# EAGLE design Motor Shield (EAGLE 9.6.2)
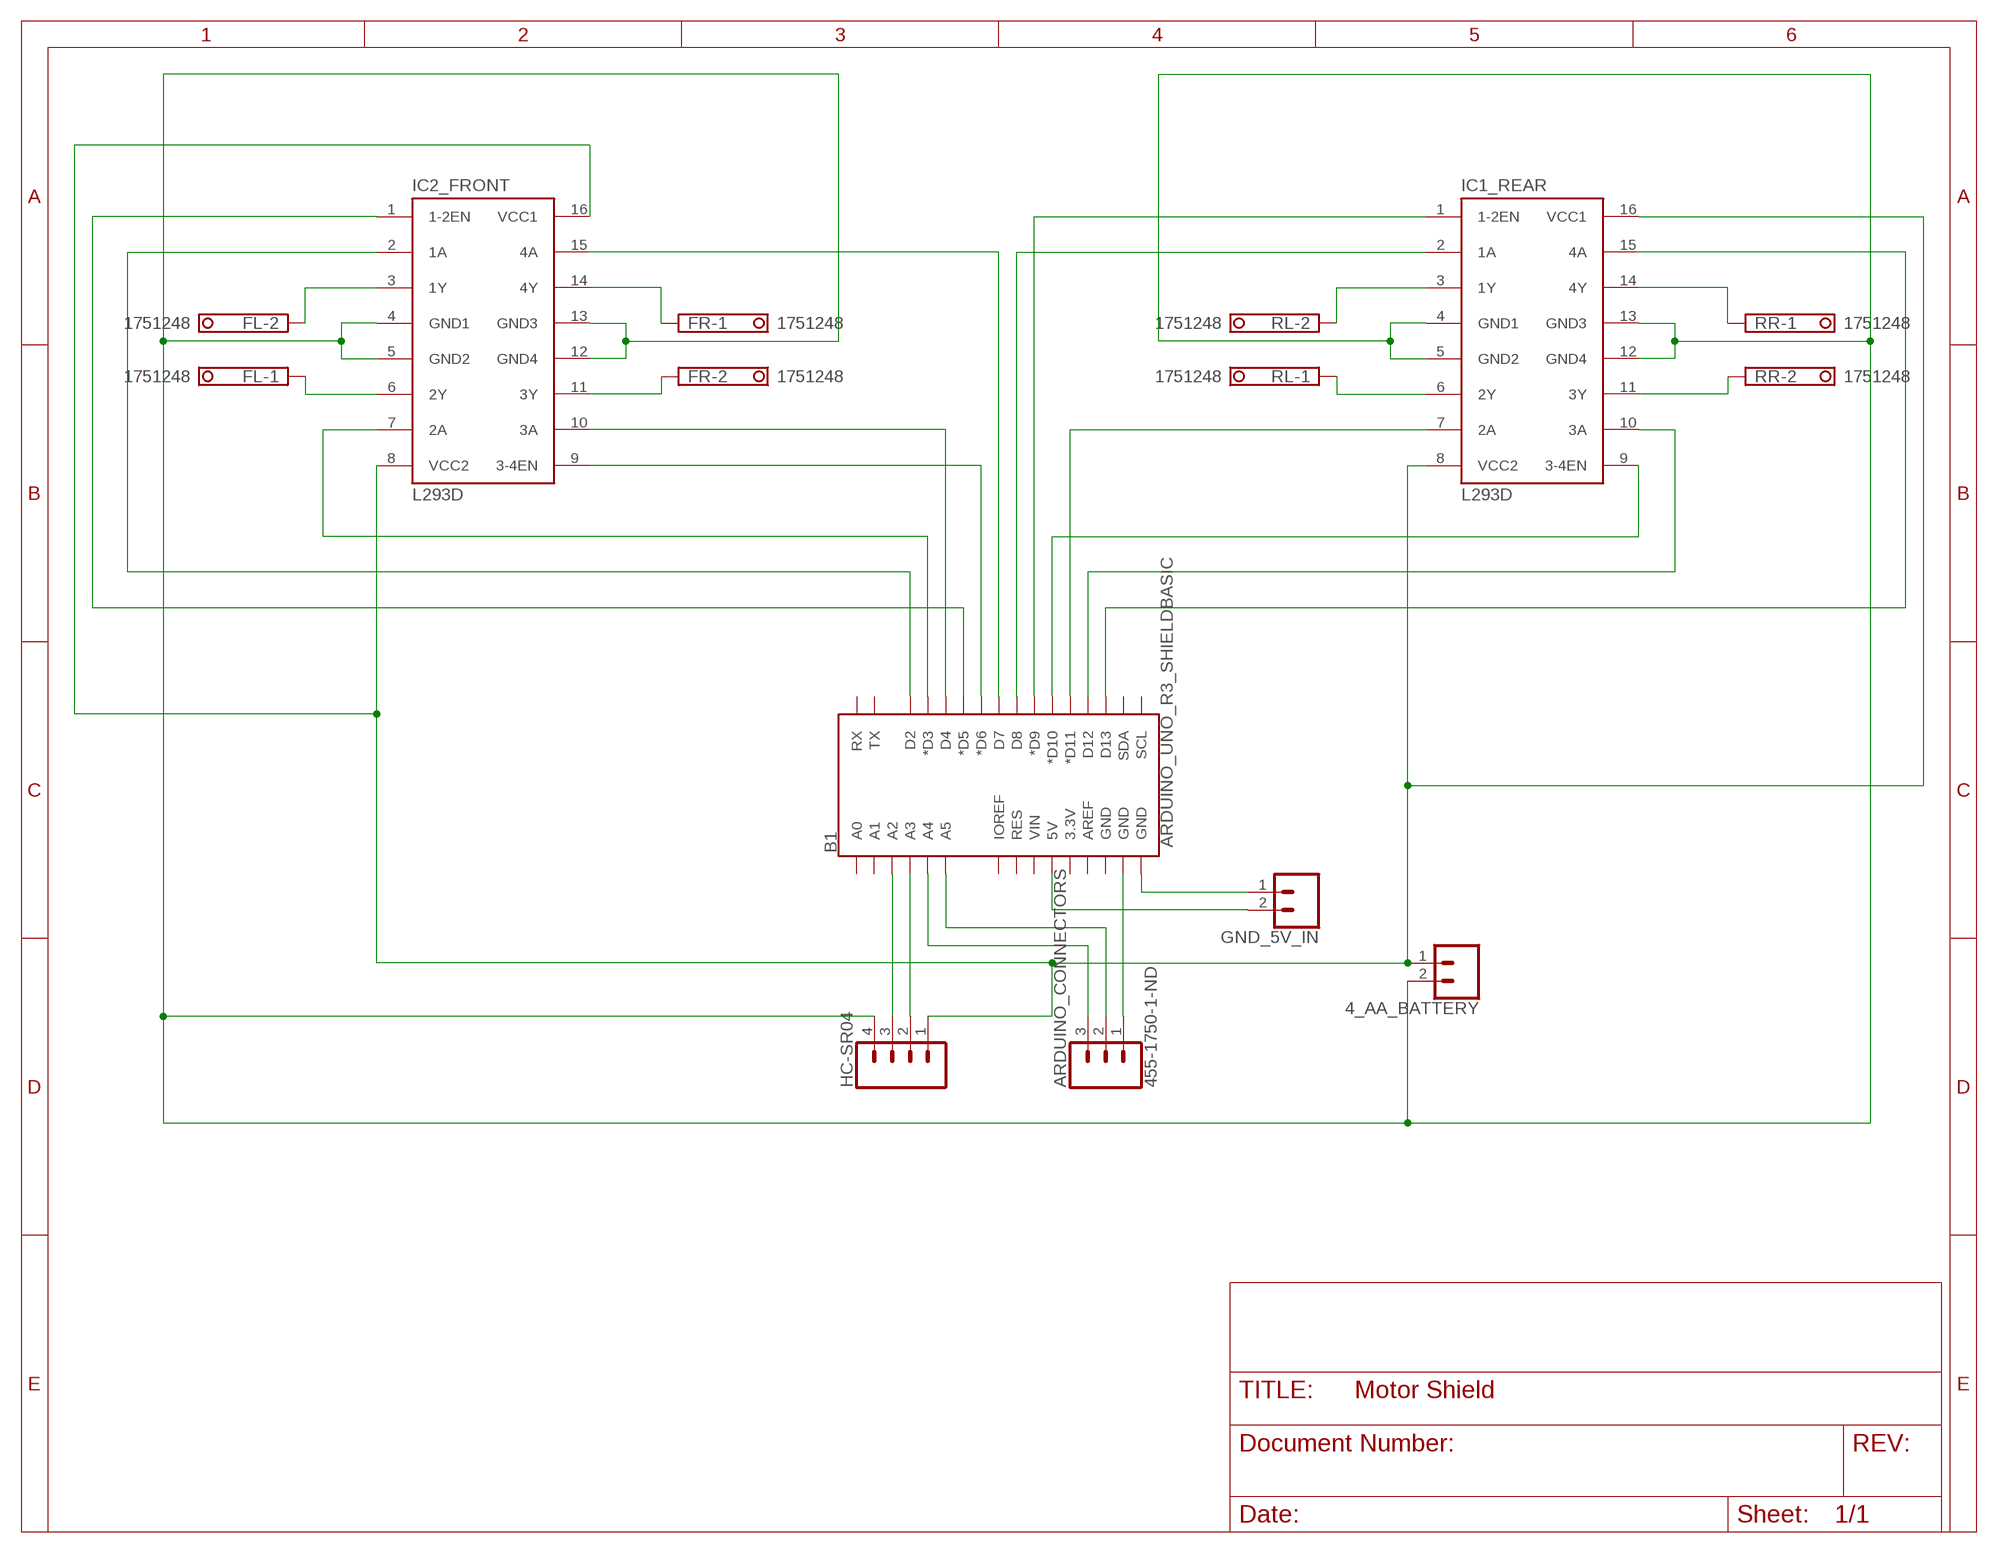
[diagram p0: schematic, sheet 1]

## Parts
4_AA_BATTERY  CONN_02  [1X02]
ARDUINO_CONNECTORS  455-1750-1-ND  CONN_03  [1X03]
B1  ARDUINO_UNO_R3_SHIELDBASIC  [UNO_R3_SHIELD]
FL  1751248  [1751248]
FR  1751248  [1751248]
GND_5V_IN  CONN_02  [1X02]
HC-SR04  CONN_04PTH  [1X04]
IC1_REAR  L293D  [DIL16]
IC2_FRONT  L293D  [DIL16]
RL  1751248  [1751248]
RR  1751248  [1751248]

## Nets
D2: B1.D2 IC2_FRONT.2(1A)
D3: B1.D3(*D3) IC2_FRONT.7(2A)
D5: B1.D5(*D5) IC2_FRONT.1(1-2EN)
GND: 4_AA_BATTERY.2 HC-SR04.4 IC1_REAR.4(GND1) IC1_REAR.5(GND2) IC1_REAR.12(GND4) IC1_REAR.13(GND3) IC2_FRONT.4(GND1) IC2_FRONT.5(GND2) IC2_FRONT.12(GND4) IC2_FRONT.13(GND3)
N$1: FL.2 IC2_FRONT.3(1Y)
N$2: FL.1 IC2_FRONT.6(2Y)
N$3: FR.1 IC2_FRONT.14(4Y)
N$4: FR.2 IC2_FRONT.11(3Y)
N$5: IC1_REAR.3(1Y) RL.2
N$6: IC1_REAR.14(4Y) RR.1
N$7: IC1_REAR.6(2Y) RL.1
N$8: IC1_REAR.11(3Y) RR.2
N$9: B1.GND@0(GND) GND_5V_IN.1
N$10: B1.D10(*D10) IC1_REAR.9(3-4EN)
N$11: B1.5V GND_5V_IN.2
N$12: B1.A2 HC-SR04.3
N$13: B1.A3 HC-SR04.2
N$14: B1.D11(*D11) IC1_REAR.7(2A)
N$15: ARDUINO_CONNECTORS.3 B1.A4
N$16: B1.D9(*D9) IC1_REAR.1(1-2EN)
N$17: B1.D12 IC1_REAR.10(3A)
N$18: B1.D13 IC1_REAR.15(4A)
N$19: B1.D8 IC1_REAR.2(1A)
N$20: B1.D7 IC2_FRONT.15(4A)
N$21: B1.D6(*D6) IC2_FRONT.9(3-4EN)
N$22: ARDUINO_CONNECTORS.2 B1.A5
N$23: B1.D4 IC2_FRONT.10(3A)
N$24: ARDUINO_CONNECTORS.1 B1.GND@1(GND)
VCC: 4_AA_BATTERY.1 HC-SR04.1 IC1_REAR.8(VCC2) IC1_REAR.16(VCC1) IC2_FRONT.8(VCC2) IC2_FRONT.16(VCC1)
Unconnected: B1.3.3V B1.A0 B1.A1 B1.AREF B1.GND@2(GND) B1.IOREF B1.RES B1.RX B1.SCL B1.SDA B1.TX B1.VIN

## Library data of the parts
4_AA_BATTERY GND_5V_IN = SparkFun-Connectors:CONN_02: Multi connection point. Often used as Generic Header-pin footprint for 0.1 inch spaced/style header connections On any of the 0.1 inch spaced packages, you can populate with these: Break Away Headers - Straight <https://www.sparkfun.com/products/116> (PRT-00116) Break Away Male Headers - Right Angle <https://www.sparkfun.com/products/553> (PRT-00553) Female Headers <https://www.sparkfun.com/products/115> (PRT-00115) Break Away Headers - Machine Pin <https://www.sparkfun.com/products/117> (PRT-00117) Break Away Female Headers - Swiss Machine Pin <https://www.sparkfun.com/products/743> (PRT-00743) For SCREWTERMINALS and SPRING TERMINALS visit here: Screw Terimnals on SparkFun.com <https://www.sparkfun.com/search/results?term=Screw+Terminals> (5mm/3.5mm/2.54mm spacing) This device is also useful as a general connection point to wire up your design to another part of your project. Our various solder wires solder well into these plated through hole pads. Hook-Up Wire - Assortment (Stranded, 22 AWG) <https://www.sparkfun.com/products/11375> (PRT-11375) Hook-Up Wire - Assortment (Solid Core, 22 AWG) <https://www.sparkfun.com/products/11367> (PRT-11367) View the entire wire category on our website here <https://www.sparkfun.com/categories/141> Special notes: Molex polarized connector foot print use with: PRT-08233 with associated crimp pins and housings. 2.54_SCREWTERM for use with PRT-10571. 3.5mm Screw Terminal footprints for PRT-08084 5mm Screw Terminal footprints for use with PRT-08432
ARDUINO_CONNECTORS = SparkFun-Connectors:CONN_03: Multi connection point. Often used as Generic Header-pin footprint for 0.1 inch spaced/style header connections On any of the 0.1 inch spaced packages, you can populate with these: Break Away Headers - Straight <https://www.sparkfun.com/products/116> (PRT-00116) Break Away Male Headers - Right Angle <https://www.sparkfun.com/products/553> (PRT-00553) Female Headers <https://www.sparkfun.com/products/115> (PRT-00115) Break Away Headers - Machine Pin <https://www.sparkfun.com/products/117> (PRT-00117) Break Away Female Headers - Swiss Machine Pin <https://www.sparkfun.com/products/743> (PRT-00743) Stackable Header - 3 Pin (Female, 0.1") <https://www.sparkfun.com/products/13875> (PRT-13875) For SCREWTERMINALS and SPRING TERMINALS visit here: Screw Terimnals on SparkFun.com <https://www.sparkfun.com/search/results?term=Screw+Terminals> (5mm/3.5mm/2.54mm spacing) This device is also useful as a general connection point to wire up your design to another part of your project. Our various solder wires solder well into these plated through hole pads. Hook-Up Wire - Assortment (Stranded, 22 AWG) <https://www.sparkfun.com/products/11375> (PRT-11375) Hook-Up Wire - Assortment (Solid Core, 22 AWG) <https://www.sparkfun.com/products/11367> (PRT-11367) View the entire wire category on our website here <https://www.sparkfun.com/categories/141> Special notes: Molex polarized connector foot print use with SKU : PRT-08232 with associated crimp pins and housings.; PROD_ID: XXX-00000
B1 = SparkFun-Boards:ARDUINO_UNO_R3_SHIELD: Arduino R3 Shield Footprint Shield form compatible with the Arduino Uno R3. SparkFun Products: MG2639 Cellular Shield <https://www.sparkfun.com/products/13120> MIDI Shield <https://www.sparkfun.com/products/12898> R3 Stackable Headers Kit <https://www.sparkfun.com/products/11417>
FL FR RL RR = con-phoenix-350:1751248: MKDS 1/ 2-3,5 Printklemme Nennstrom: 10 A Bemessungsspannung: 160 V Raster: 3,5 mm Polzahl: 2 Montageart: Löten Anschlussart: Schraubanschluss Anschlussrichtung vom Leiter zur Platine: 0° Source: http://eshop.phoenixcontact.com .. 1751248.pdf; OC_FARNELL: unknown; OC_NEWARK: unknown
HC-SR04 = SparkFun-Connectors:CONN_04: Multi connection point. Often used as Generic Header-pin footprint for 0.1 inch spaced/style header connections On any of the 0.1 inch spaced packages, you can populate with these: Break Away Headers - Straight <https://www.sparkfun.com/products/116> (PRT-00116) Break Away Male Headers - Right Angle <https://www.sparkfun.com/products/553> (PRT-00553) Female Headers <https://www.sparkfun.com/products/115> (PRT-00115) Break Away Headers - Machine Pin <https://www.sparkfun.com/products/117> (PRT-00117) Break Away Female Headers - Swiss Machine Pin <https://www.sparkfun.com/products/743> (PRT-00743) For SCREWTERMINALS and SPRING TERMINALS visit here: Screw Terimnals on SparkFun.com <https://www.sparkfun.com/search/results?term=Screw+Terminals> (5mm/3.5mm/2.54mm spacing) This device is also useful as a general connection point to wire up your design to another part of your project. Our various solder wires solder well into these plated through hole pads. Hook-Up Wire - Assortment (Stranded, 22 AWG) <https://www.sparkfun.com/products/11375> (PRT-11375) Hook-Up Wire - Assortment (Solid Core, 22 AWG) <https://www.sparkfun.com/products/11367> (PRT-11367) View the entire wire category on our website here <https://www.sparkfun.com/categories/141> Special notes: Molex polarized connector foot print use with SKU : PRT-08231 with associated crimp pins and housings. 1MM SMD Version SKU: PRT-10208; PROD_ID: CONN-09696
IC1_REAR IC2_FRONT = st-microelectronics:L293D: PUSH-PULL 4 CHANNEL DRIVER; MPN: L293D; OC_FARNELL: 9589619; OC_NEWARK: 56P8249

## Net classes
0 default: width 1.016 mm, drill 1.016 mm, clearance 0.508 mm

## Board
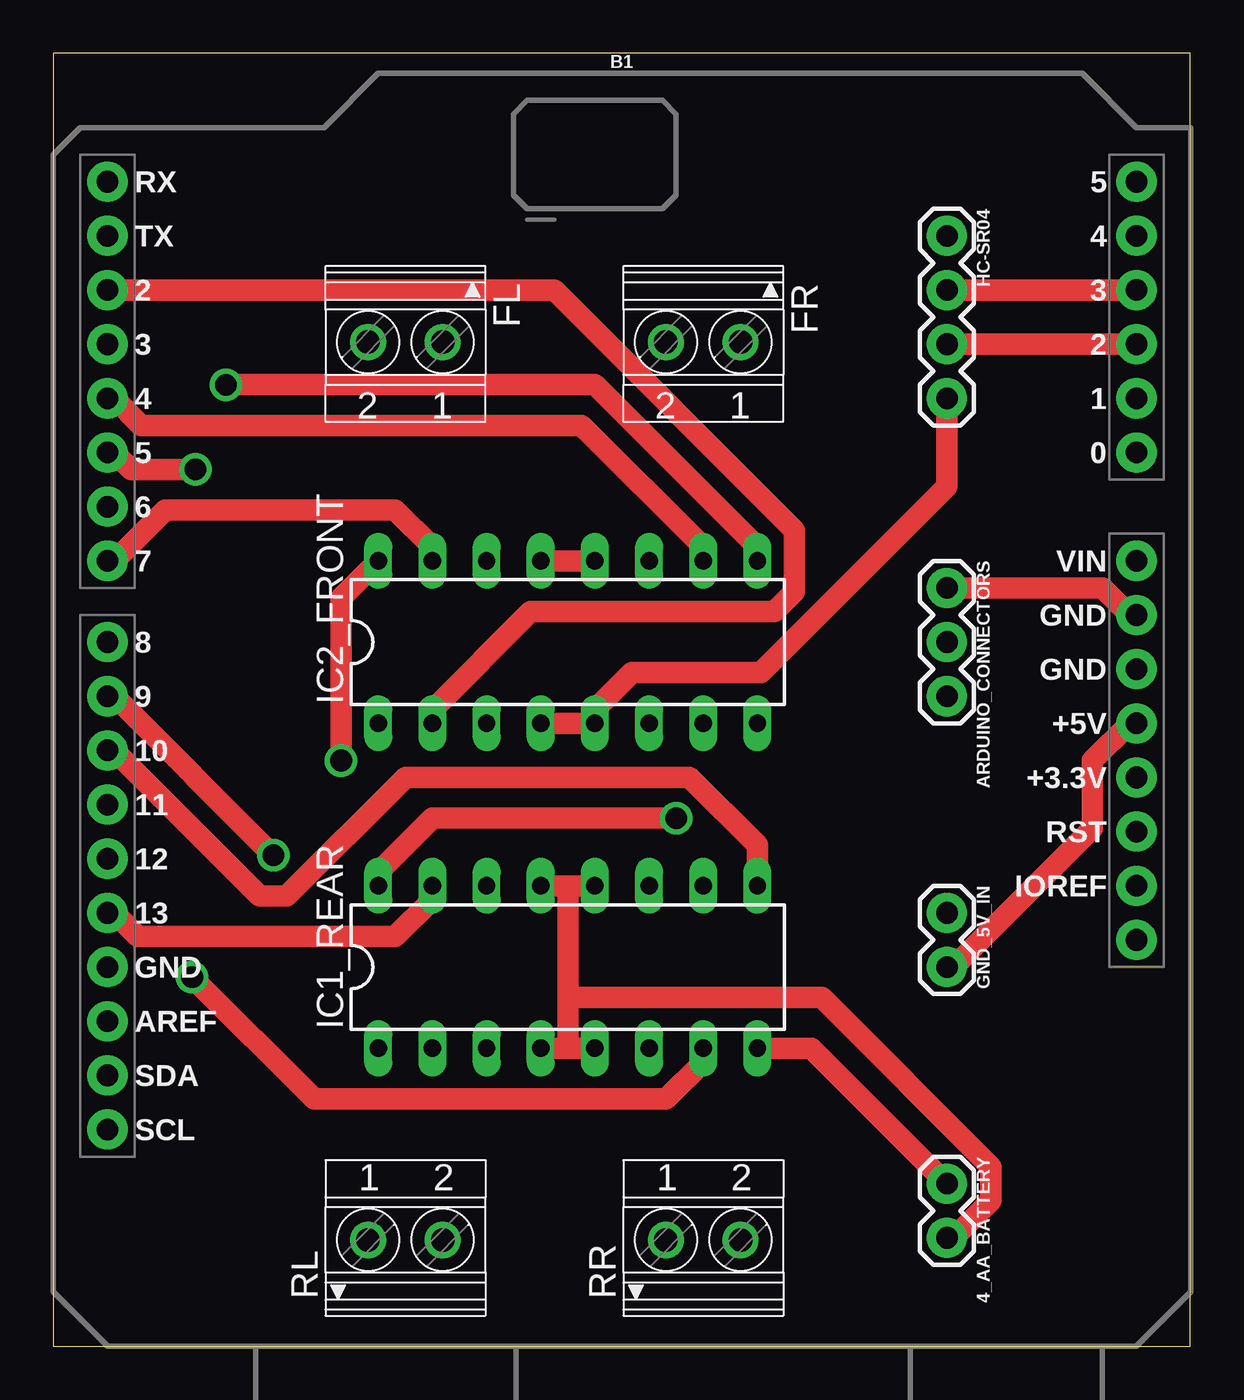
[diagram p1: board, top side]
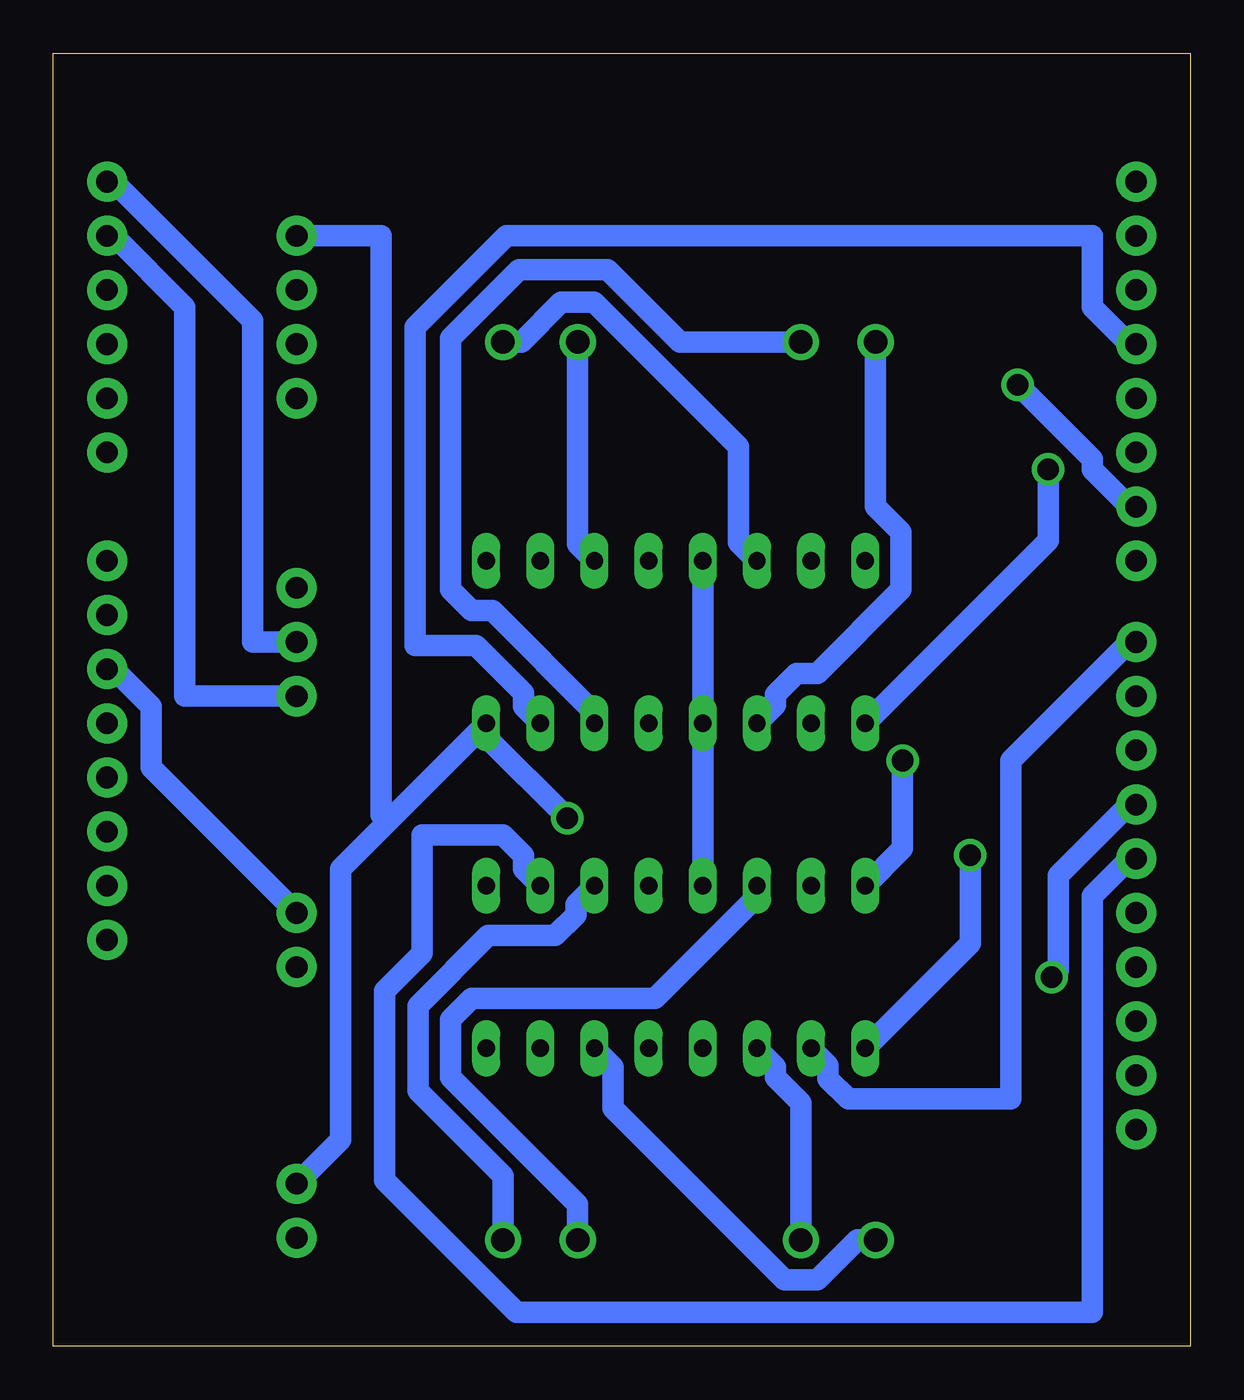
[diagram p2: board, bottom side, seen from below]

Size 53.32 x 60.63 mm. Coordinates in mm from the lower left corner, seen from the top.
Outline: 0,0 53.32,0 53.32,60.63 0,60.63 0,0
Copper layers (1*16): Top 0.035mm / dielectric 1.5mm / Bottom 0.035mm
Design rules "default": minimum track width 6mil, minimum drill 0.35mm, track to track 6mil, track to pad 6mil, pad to pad 6mil, via to via 6mil, smd to smd 6mil, copper to edge 40mil, drill to drill 6mil, minimum pad ring 10mil, minimum via ring 8mil, stop-mask expansion 4mil, vias tented up to drill 0mil, thermal gap 10mil

### Footprints (pad centres in the part's own frame; a part is rotated, then mirrored left to right if it is on the bottom)
1X02 = drill 1.016 pad 1.88: 1 0,0; 2 2.54,0
1X03 = drill 1.016 pad 1.88: 1 0,0; 2 2.54,0; 3 5.08,0
UNO_R3_SHIELD = drill 1.016 pad 1.88: 3.3V 24.13,-2.54; 5V 24.13,0; A0 24.13,12.7; A1 24.13,15.24; A2 24.13,17.78; A3 24.13,20.32; A4 24.13,22.86; A5 24.13,25.4; AREF -24.13,-13.97; D2 -24.13,20.32; D3 -24.13,17.78; D4 -24.13,15.24; D5 -24.13,12.7; D6 -24.13,10.16; D7 -24.13,7.62; D8 -24.13,3.81; D9 -24.13,1.27; D10 -24.13,-1.27; D11 -24.13,-3.81; D12 -24.13,-6.35; D13 -24.13,-8.89; GND@0 24.13,2.54; GND@1 24.13,5.08; GND@2 -24.13,-11.43; IOREF 24.13,-7.62; NC 24.13,-10.16; RES 24.13,-5.08; RX -24.13,25.4; SCL -24.13,-19.05; SDA -24.13,-16.51; TX -24.13,22.86; VIN 24.13,7.62
1751248 = drill 1.1 pad 1.7: 1 -1.75,-0.1; 2 1.75,-0.1
1X04 = drill 1.016 pad 1.88: 1 0,0; 2 2.54,0; 3 5.08,0; 4 7.62,0
DIL16 = drill 0.813 long: 1 -8.89,-3.81; 2 -6.35,-3.81; 3 -3.81,-3.81; 4 -1.27,-3.81; 5 1.27,-3.81; 6 3.81,-3.81; 7 6.35,-3.81; 8 8.89,-3.81; 9 8.89,3.81; 10 6.35,3.81; 11 3.81,3.81; 12 1.27,3.81; 13 -1.27,3.81; 14 -3.81,3.81; 15 -6.35,3.81; 16 -8.89,3.81

### Placement (x,y rotation side)
4_AA_BATTERY  41.91,7.62 270 top
ARDUINO_CONNECTORS  41.91,35.56 270 top
B1  26.67,29.21 0 top
FL  16.51,46.99 180 top
FR  30.48,46.99 180 top
GND_5V_IN  41.91,20.32 270 top
HC-SR04  41.91,52.07 270 top
IC1_REAR  24.13,17.78 0 top
IC2_FRONT  24.13,33.02 0 top
RL  16.51,5.08 0 top
RR  30.48,5.08 0 top

### Tracks (layer width: path | path; a pad name or v marks a point on that pad's centre or on a via)
D2
  Top 1.016: IC2_FRONT.2 17.78,29.84 22.38,34.45 33.81,34.45 34.77,35.4 34.77,38.26 23.5,49.53 B1.D2
D3
  Bottom 1.016: IC2_FRONT.7 31.27,30 31.27,30.64 33.5,32.86 36.35,32.86 36.35,47.78 32.07,52.07 4.6,52.07 4.6,48.74 2.86,46.99 B1.D3
D5  (via drill 1.02)
  Top 1.016: v6.67,41.12 3.65,41.12 2.86,41.91 B1.D5
  Bottom 1.016: IC2_FRONT.1 6.67,37.78 v6.67,41.12
GND
  Top 1.016: IC2_FRONT.4 IC2_FRONT.5 25.24,29.69 27.15,31.59 33.18,31.59 41.91,40.32 HC-SR04.4 | IC2_FRONT.12 IC2_FRONT.13 | IC1_REAR.5 24.13,13.97 | 24.13,13.97 IC1_REAR.4 | IC1_REAR.12 24.13,21.59 | 24.13,21.59 IC1_REAR.13 | 24.13,21.59 24.13,16.35 | 24.13,16.35 24.13,13.97 | 4_AA_BATTERY.2 42.23,5.08 43.97,6.83 43.97,8.41 36.04,16.35 24.13,16.35
  Bottom 1.016: IC2_FRONT.13 IC2_FRONT.4 IC1_REAR.13
N$1
  Bottom 1.016: IC2_FRONT.3 19.46,30.07 19.46,30.57 18.47,31.55 17.49,31.55 13.56,35.48 13.56,38.19 14.76,39.38 FL.2
N$2
  Bottom 1.016: FL.1 23.94,47.09 27.33,50.48 31.48,50.48 34.7,47.26 34.7,35.48 33.71,34.49 32.73,34.49 27.94,29.7 IC2_FRONT.6
N$3
  Bottom 1.016: IC2_FRONT.14 21.18,37.69 21.18,42.18 27.96,48.96 29.5,48.96 31.37,47.09 FR.1
N$4
  Bottom 1.016: FR.2 28.73,37.62 IC2_FRONT.11
N$5
  Bottom 1.016: IC1_REAR.3 19.46,13.11 19.46,12.62 18.26,11.42 RL.2
N$6
  Bottom 1.016: IC1_REAR.14 20.32,21.1 25.11,16.31 33.71,16.31 34.7,15.32 34.7,12.62 28.73,6.65 RR.1
N$7
  Bottom 1.016: IC1_REAR.6 27.08,13.11 27.08,11.16 19.03,3.11 17.49,3.11 15.62,4.98 RL.1
N$8
  Bottom 1.016: RR.2 32.23,7.99 36.22,11.98 36.22,15.96 32.92,19.25 29.79,19.25 28.8,20.23 28.8,20.73 IC1_REAR.11
N$9
  Bottom 1.016: GND_5V_IN.1 48.74,27.15 48.74,30 50.48,31.75 B1.GND@0
N$10
  Top 1.016: IC1_REAR.9 33.02,23.5 29.84,26.67 16.51,26.67 10.95,21.11 9.68,21.11 2.86,27.94 B1.D10
N$11
  Top 1.016: GND_5V_IN.2 42.23,17.78 48.74,24.29 48.74,27.46 50.48,29.21 B1.5V
N$12
  Top 1.016: B1.A2 HC-SR04.3
N$13
  Top 1.016: B1.A3 HC-SR04.2
N$14  (via drill 1.02)
  Top 1.016: IC1_REAR.7 30.48,13.34 28.73,11.59 12.22,11.59 v6.51,17.3
  Bottom 1.016: v6.51,17.3 6.19,17.62 6.19,22.07 2.86,25.4 B1.D11
N$15
  Bottom 1.016: ARDUINO_CONNECTORS.3 47.15,30.48 47.15,48.74 50.48,52.07 B1.A4
N$16  (via drill 1.02)
  Top 1.016: v10.32,23.02 2.86,30.48 B1.D9
  Bottom 1.016: IC1_REAR.1 10.32,18.89 v10.32,23.02
N$17
  Bottom 1.016: IC1_REAR.10 31.27,22.38 31.27,23.02 32.23,23.97 36.04,23.97 36.04,18.41 37.78,16.67 37.78,7.78 31.59,1.59 4.6,1.59 4.6,21.11 2.86,22.86 B1.D12
N$18
  Top 1.016: IC1_REAR.15 17.78,20.95 16.03,19.21 3.97,19.21 2.86,20.32 B1.D13
N$19
  Bottom 1.016: IC1_REAR.2 16.99,13.18 16.99,12.54 16.03,11.59 8.41,11.59 8.41,27.46 2.86,33.02 B1.D8
N$20
  Top 1.016: IC2_FRONT.15 17.78,37.47 16.03,39.21 5.24,39.21 2.86,36.83 B1.D7
N$21  (via drill 1.02)
  Top 1.016: IC2_FRONT.9 33.02,37.47 25.4,45.09 v8.1,45.09
  Bottom 1.016: v8.1,45.09 4.6,41.59 4.6,41.12 2.86,39.37 B1.D6
N$22
  Bottom 1.016: ARDUINO_CONNECTORS.2 43.97,33.02 43.97,48.1 50.48,54.61 B1.A5
N$23
  Top 1.016: IC2_FRONT.10 30.48,37.47 24.77,43.18 4.13,43.18 2.86,44.45 B1.D4
N$24
  Top 1.016: ARDUINO_CONNECTORS.1 49.21,35.56 50.48,34.29 B1.GND@1
VCC  (via drill 1.02)
  Top 1.016: v13.49,27.46 13.49,35.08 IC2_FRONT.16 | IC1_REAR.8 35.56,13.97 4_AA_BATTERY.1 | IC1_REAR.16 15.24,22.23 17.78,24.77 v29.21,24.77
  Bottom 1.016: IC1_REAR.16 13.49,23.34 v13.49,27.46 | 37.62,24.61 39.85,22.38 39.85,9.68 4_AA_BATTERY.1 | 37.62,24.61 IC2_FRONT.8 33.02,28.57 v29.21,24.77 | HC-SR04.1 37.94,52.07 37.94,24.92 37.62,24.61